# EAGLE design InstrDigitizer2 (EAGLE 8.0.1)

## Sheet 1 of 2
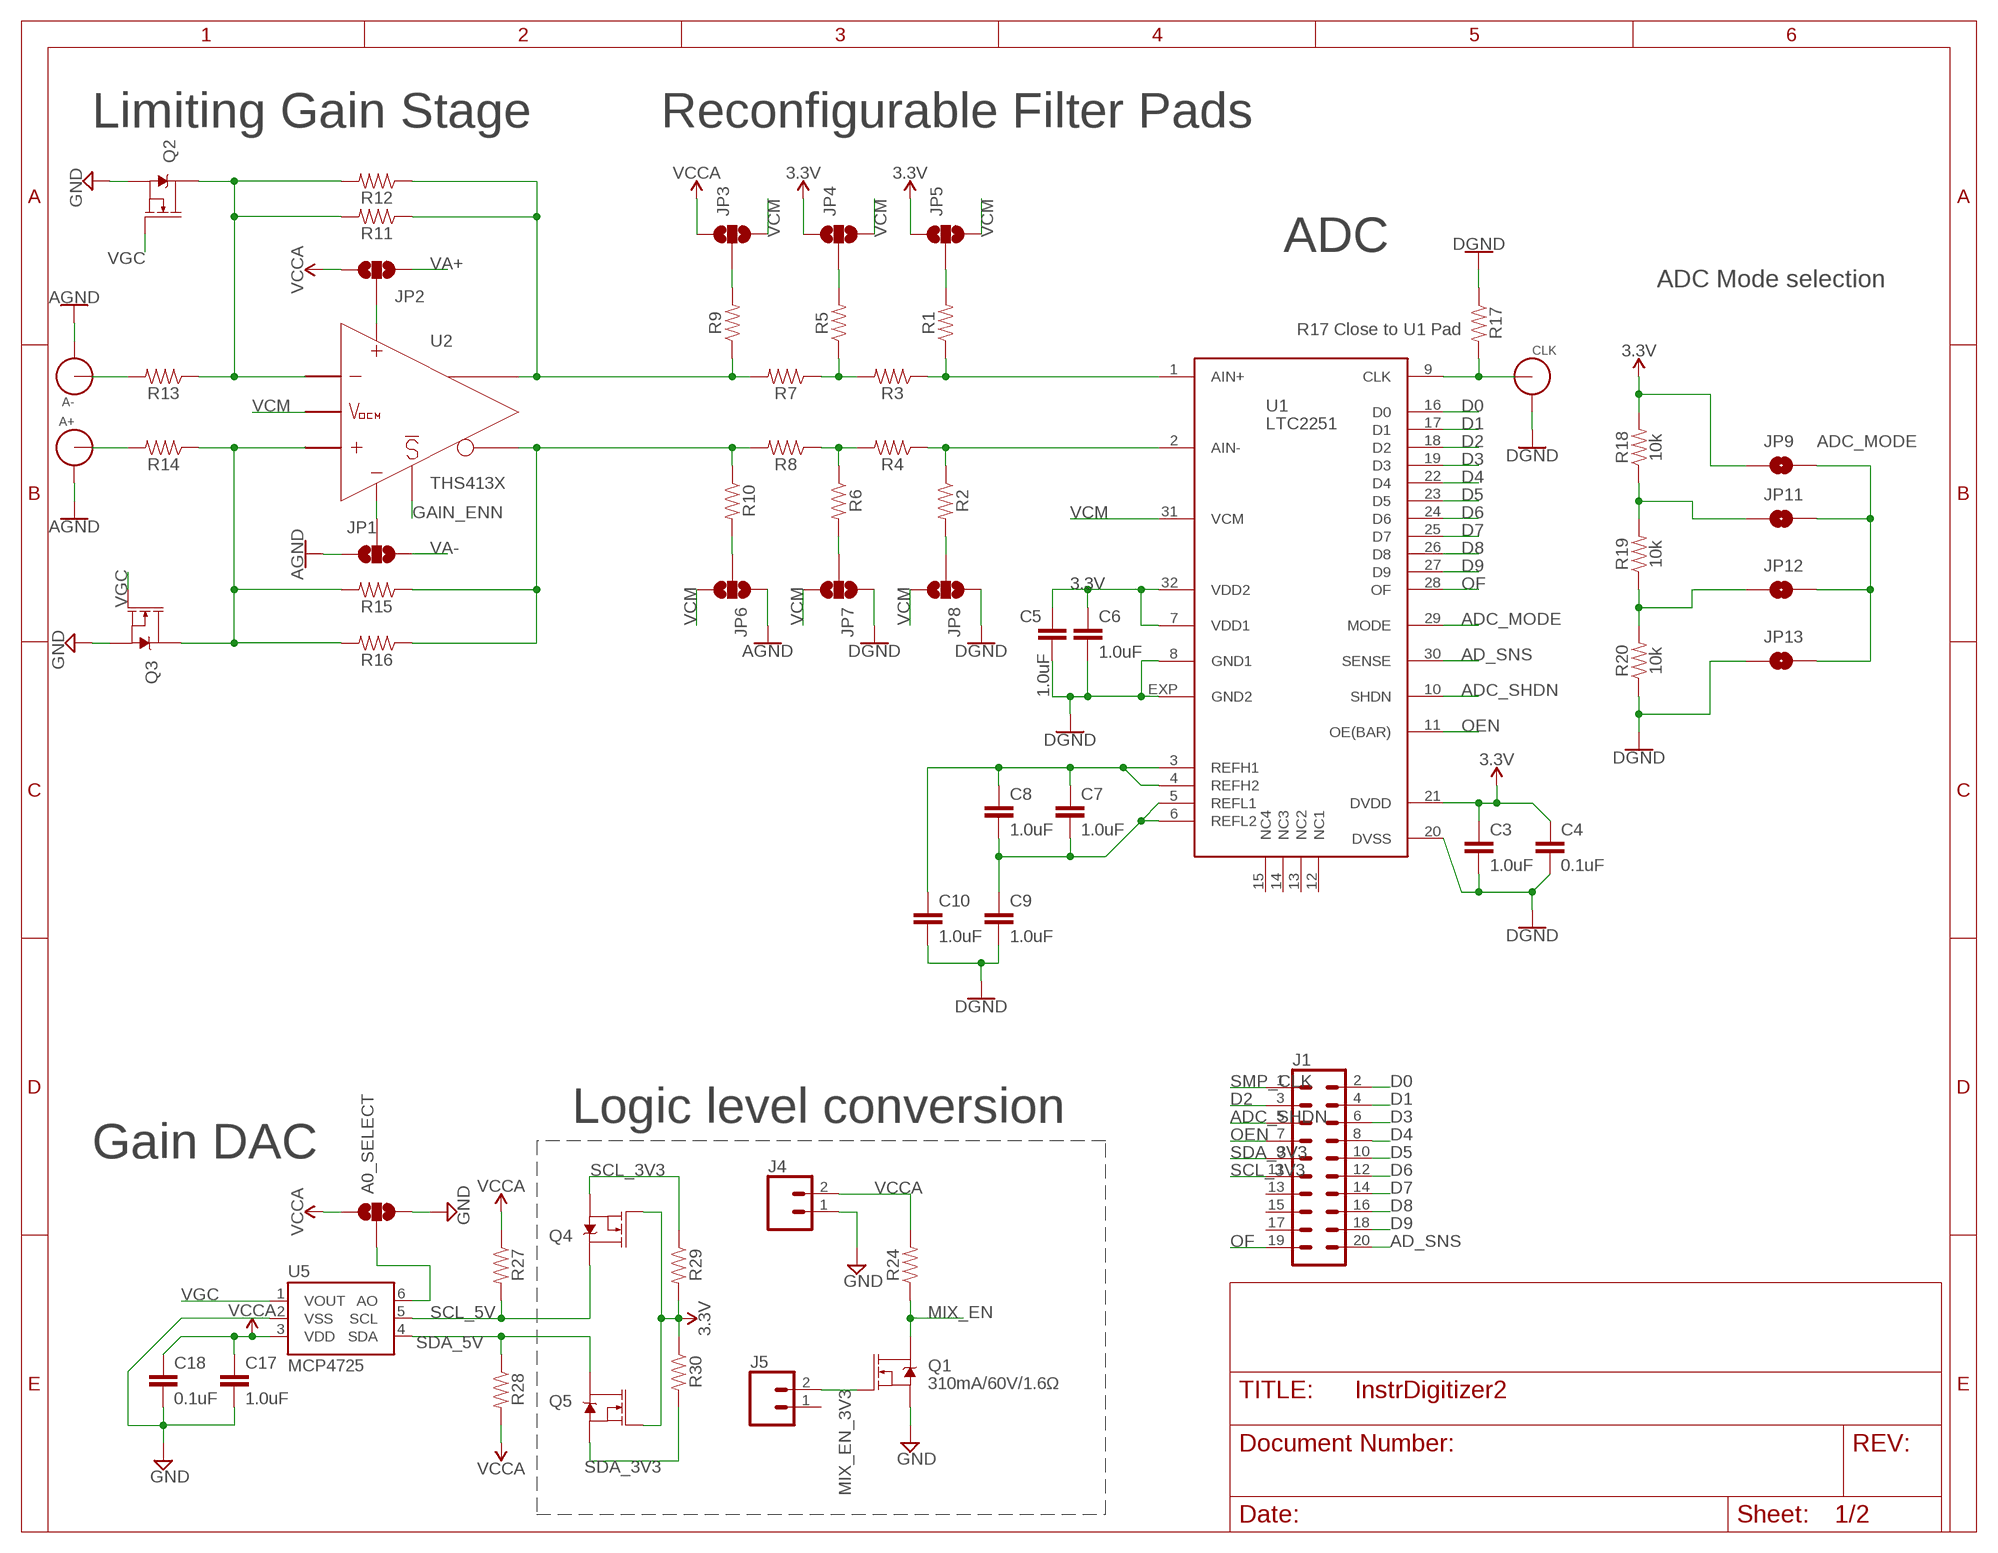
[diagram p0: schematic, sheet 1]

### Parts
A0_SELECT  JUMPER-SMT_3_NO_SILK  [SMT-JUMPER_3_NO_SILK]
A+  LINX-SMA-EDGE-0.062  [CONSMA003.062]
A-  LINX-SMA-EDGE-0.062  [CONSMA003.062]
C3  1.0uF  1.0UF-0402-16V-10%  [0402]
C4  0.1uF  0.1UF-0402-16V-10%  [0402]
C5  1.0uF  1.0UF-0402-16V-10%  [0402]
C6  1.0uF  1.0UF-0402-16V-10%  [0402]
C7  1.0uF  1.0UF-0402-16V-10%  [0402]
C8  1.0uF  1.0UF-0402-16V-10%  [0402]
C9  1.0uF  1.0UF-0402-16V-10%  [0402]
C10  1.0uF  1.0UF-0402-16V-10%  [0402]
C17  1.0uF  1.0UF-0402-16V-10%  [0402]
C18  0.1uF  0.1UF-0402-16V-10%  [0402]
CLK  LINX-SMA-EDGE-0.062  [CONSMA003.062]
J1  CONN_10X2  [2X10]
J4  CONN_02  [1X02]
J5  CONN_02  [1X02]
JP1  JUMPER-SMT_3_NO_SILK  [SMT-JUMPER_3_NO_SILK]
JP2  JUMPER-SMT_3_NO_SILK  [SMT-JUMPER_3_NO_SILK]
JP3  JUMPER-SMT_3_NO_SILK  [SMT-JUMPER_3_NO_SILK]
JP4  JUMPER-SMT_3_NO_SILK  [SMT-JUMPER_3_NO_SILK]
JP5  JUMPER-SMT_3_NO_SILK  [SMT-JUMPER_3_NO_SILK]
JP6  JUMPER-SMT_3_NO_SILK  [SMT-JUMPER_3_NO_SILK]
JP7  JUMPER-SMT_3_NO_SILK  [SMT-JUMPER_3_NO_SILK]
JP8  JUMPER-SMT_3_NO_SILK  [SMT-JUMPER_3_NO_SILK]
JP9  JUMPER-SMT_2_NO_NO-SILK  [SMT-JUMPER_2_NO_NO-SILK]
JP11  JUMPER-SMT_2_NO_NO-SILK  [SMT-JUMPER_2_NO_NO-SILK]
JP12  JUMPER-SMT_2_NO_NO-SILK  [SMT-JUMPER_2_NO_NO-SILK]
JP13  JUMPER-SMT_2_NO_NO-SILK  [SMT-JUMPER_2_NO_NO-SILK]
Q1  310mA/60V/1.6Ω  MOSFET-NCH-2N7002PW  [SOT323]
Q2  MOSFET-NCH-AO3404A  [SOT23-3]
Q3  MOSFET-NCH-AO3404A  [SOT23-3]
Q4  MOSFET-NCH-AO3404A  [SOT23-3]
Q5  MOSFET-NCH-AO3404A  [SOT23-3]
R1  RESISTOR0402  [0402]
R2  RESISTOR0402  [0402]
R3  RESISTOR0402  [0402]
R4  RESISTOR0402  [0402]
R5  RESISTOR0402  [0402]
R6  RESISTOR0402  [0402]
R7  RESISTOR0402  [0402]
R8  RESISTOR0402  [0402]
R9  RESISTOR0402  [0402]
R10  RESISTOR0402  [0402]
R11  RESISTOR0402  [0402]
R12  RESISTOR0402  [0402]
R13  RESISTOR0402  [0402]
R14  RESISTOR0402  [0402]
R15  RESISTOR0402  [0402]
R16  RESISTOR0402  [0402]
R17  RESISTOR0402  [0402]
R18  10k  RESISTOR0402  [0402]
R19  10k  RESISTOR0402  [0402]
R20  10k  RESISTOR0402  [0402]
R24  RESISTOR0402  [0402]
R27  RESISTOR0402  [0402]
R28  RESISTOR0402  [0402]
R29  RESISTOR0402  [0402]
R30  RESISTOR0402  [0402]
U1  LTC2251  [HVQFN32]
U2  THS413X  [SO08]
U5  MCP4725  MCP4725SOT-23  [SOT23-6]

### Nets
3.3V: C3.1 C4.1 C5.1 C6.1 JP4.1 JP5.1 JP9.1 Q4.1(G) Q5.1(G) R18.2 R29.2 R30.1 U1.7(VDD1) U1.21(DVDD) U1.32(VDD2) ; also sheet 2
AD_SNS: J1.20 U1.30(SENSE)
ADC_MODE: JP9.2 JP11.2 JP12.2 JP13.2 U1.29(MODE)
ADC_SHDN: J1.5 U1.10(SHDN)
AMP+: Q3.3(D) R14.1 R15.2 R16.2 U2.8
AMP-: Q2.3(D) R11.2 R12.2 R13.1 U2.1
D0: J1.2 U1.16(D0)
D1: J1.4 U1.17(D1)
D2: J1.3 U1.18(D2)
D3: J1.6 U1.19(D3)
D4: J1.8 U1.22(D4)
D5: J1.10 U1.23(D5)
D6: J1.12 U1.24(D6)
D7: J1.14 U1.25(D7)
D8: J1.16 U1.26(D8)
D9: J1.18 U1.27(D9)
GAIN_ENN: U2.7
GND: A0_SELECT.3 A+.GND1 A+.GND2 A+.GND3 A+.GND4 A-.GND1 A-.GND2 A-.GND3 A-.GND4 C3.2 C4.2 C5.2 C6.2 C9.2 C10.2 C17.2 C18.2 CLK.GND1 CLK.GND2 CLK.GND3 CLK.GND4 J4.1 JP1.3 JP6.1 JP7.1 JP8.1 JP13.1 Q1.2(S) Q2.2(S) Q3.2(S) R17.1 R20.1 U1.8(GND1) U1.20(DVSS) U1.EXP(GND2) U5.2(VSS) ; supply symbol labelled DGND, AGND ; also sheet 2
MIX_EN: Q1.3(D) R24.1 ; also sheet 2
MIX_EN_3V3: J5.2 Q1.1(G)
N$1: JP2.2 U2.3
N$2: JP1.2 U2.6
N$3: R7.2 R9.1 R11.1 R12.1 U2.4
N$4: R3.2 R5.1 R7.1
N$5: R1.1 R3.1 U1.1(AIN+)
N$6: R8.2 R10.1 R15.1 R16.1 U2.5
N$7: R4.2 R6.1 R8.1
N$8: R2.1 R4.1 U1.2(AIN-)
N$9: JP3.2 R9.2
N$10: JP4.2 R5.2
N$11: JP5.2 R1.2
N$12: JP8.2 R2.2
N$13: JP7.2 R6.2
N$14: JP6.2 R10.2
N$15: A-.ANT R13.2
N$16: A+.ANT R14.2
N$21: C7.1 C8.1 C10.1 U1.3(REFH1) U1.4(REFH2)
N$22: JP12.1 R19.1 R20.2
N$23: C7.2 C8.2 C9.1 U1.5(REFL1) U1.6(REFL2)
N$30: JP11.1 R18.1 R19.2
N$39: A0_SELECT.2 U5.6(AO)
OEN: J1.7 U1.11(OE(BAR))
OF: J1.19 U1.28(OF)
SCL_3V3: J1.11 Q4.2(S) R29.1
SCL_5V: Q4.3(D) R27.2 U5.5(SCL)
SDA_3V3: J1.9 Q5.2(S) R30.2
SDA_5V: Q5.3(D) R28.1 U5.4(SDA)
SMP_CLK: CLK.ANT J1.1 R17.2 U1.9(CLK)
VA+: JP2.3
VA-: JP1.1
VCCA: A0_SELECT.1 C17.1 C18.1 J4.2 JP2.1 JP3.1 R24.2 R27.1 R28.2 U5.3(VDD) ; also sheet 2
VCM: JP3.3 JP4.3 JP5.3 JP6.3 JP7.3 JP8.3 U1.31(VCM) U2.2
VGC: Q2.1(G) Q3.1(G) U5.1(VOUT)
Unconnected: J1.13 J1.15 J1.17 J5.1 U1.12(NC1) U1.13(NC2) U1.14(NC3) U1.15(NC4)

### Notes on the sheet
- Limiting Gain Stage | Reconfigurable Filter Pads
- ADC
- ADC Mode selection
- R17 Close to U1 Pad
- Logic level conversion
- Gain DAC

## Sheet 2 of 2
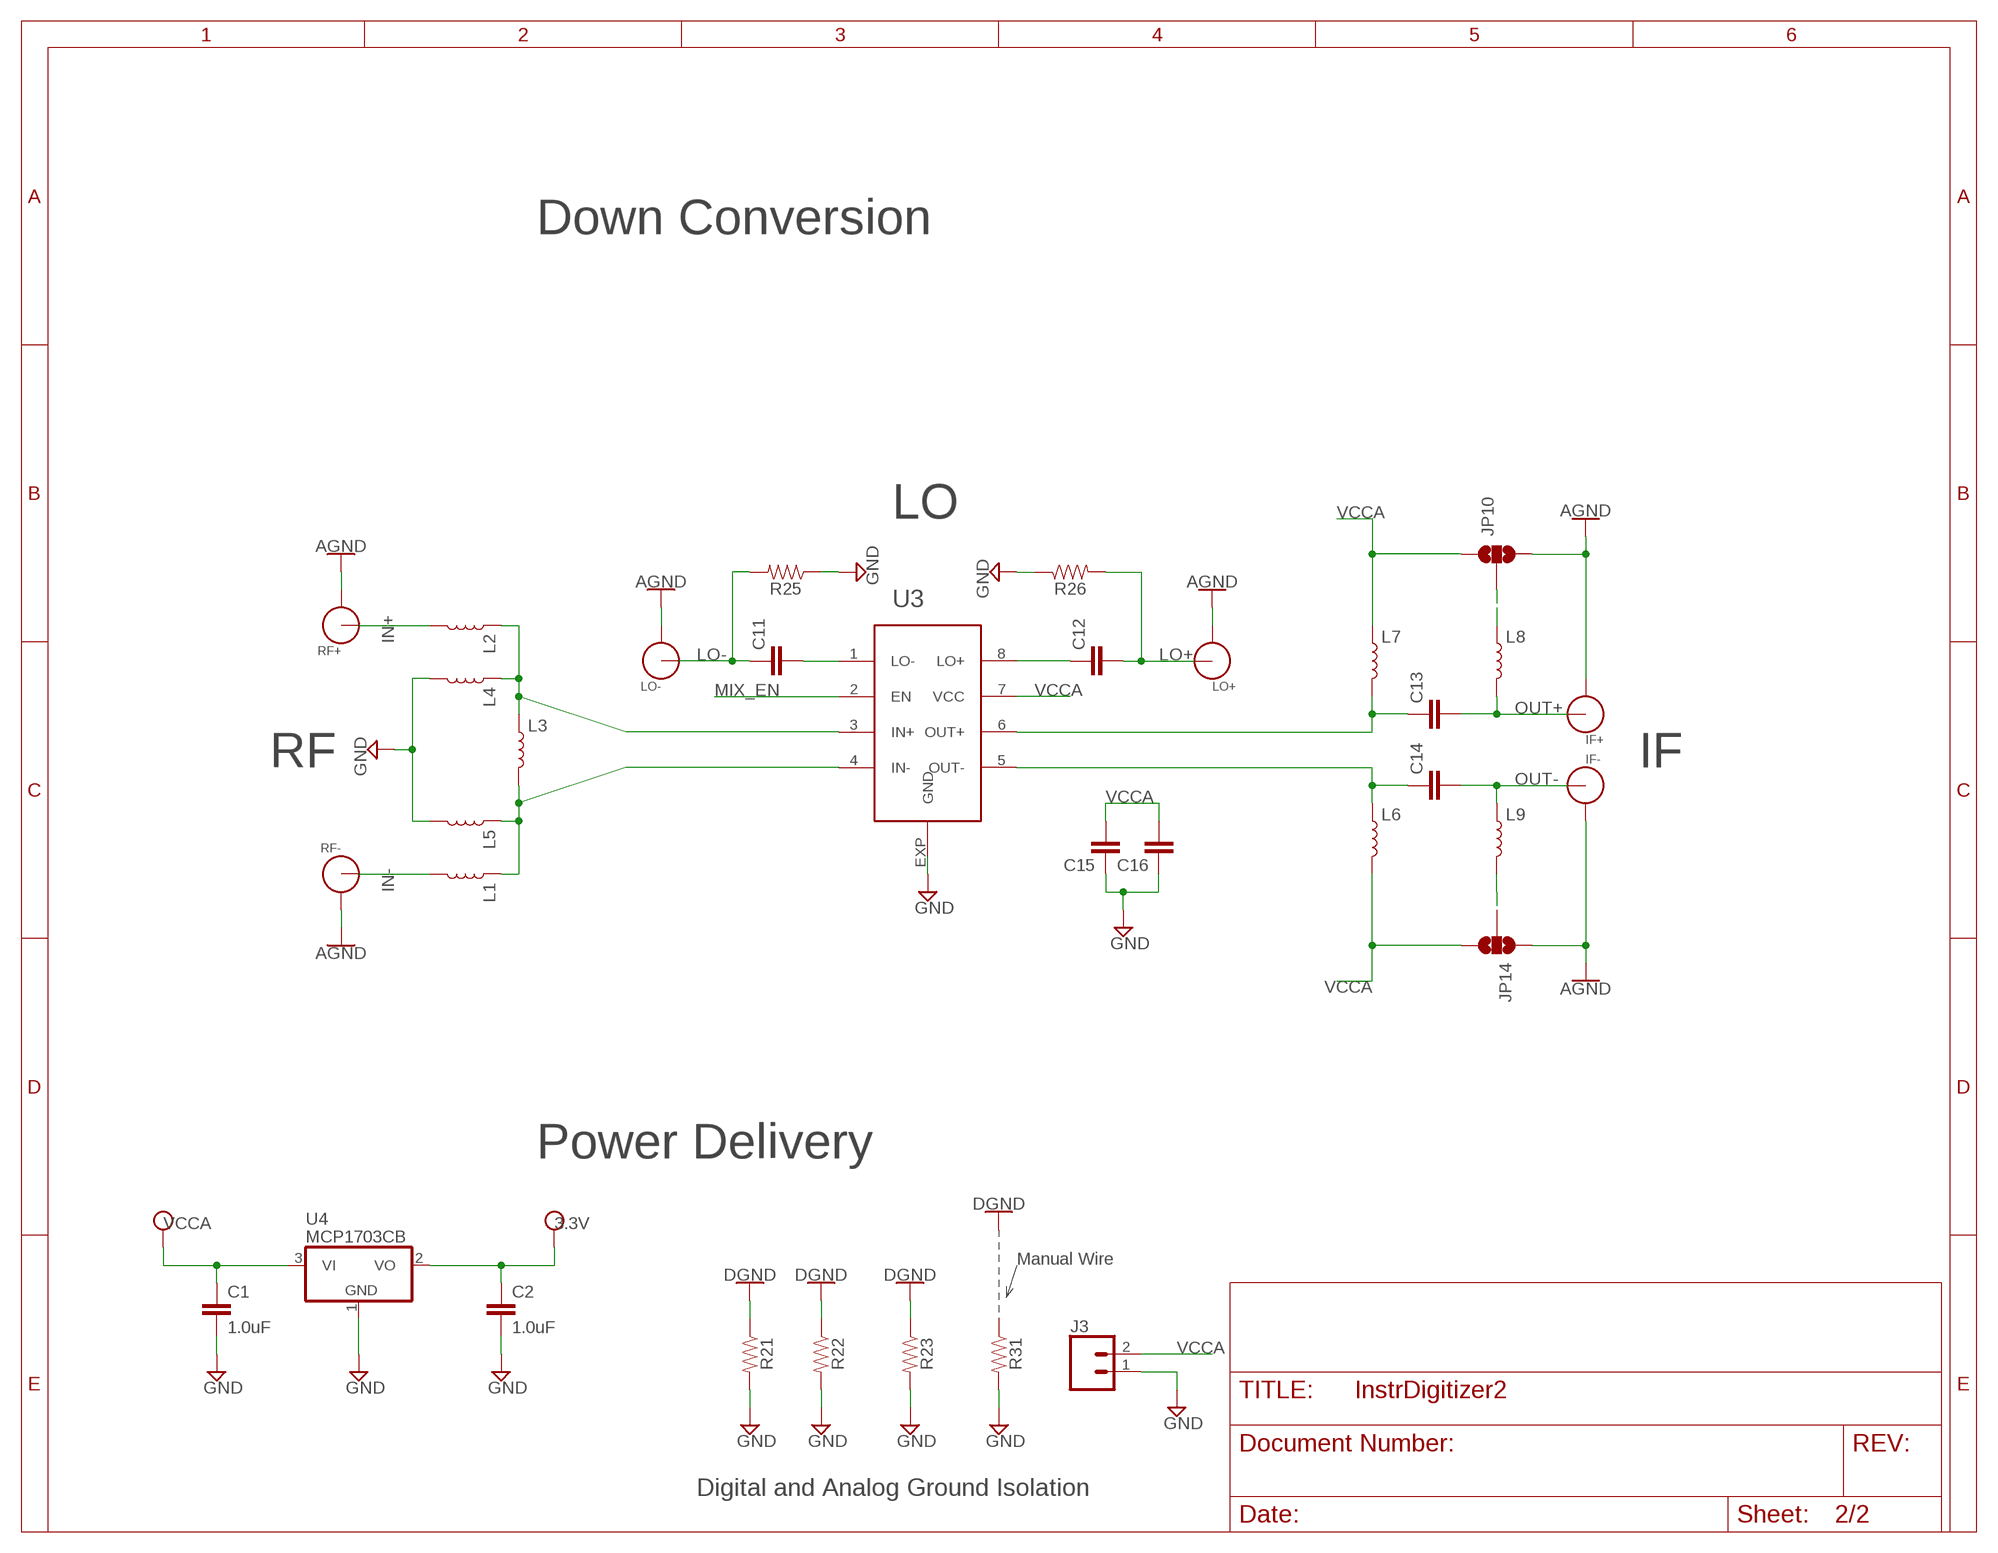
[diagram p1: schematic, sheet 2]

### Parts
C1  1.0uF  1.0UF-0402-16V-10%  [0402]
C2  1.0uF  1.0UF-0402-16V-10%  [0402]
C11  1.0UF-0402-16V-10%  [0402]
C12  1.0UF-0402-16V-10%  [0402]
C13  1.0UF-0402-16V-10%  [0402]
C14  1.0UF-0402-16V-10%  [0402]
C15  1.0UF-0402-16V-10%  [0402]
C16  1.0UF-0402-16V-10%  [0402]
IF+  LINX-SMA-EDGE-0.062  [CONSMA003.062]
IF-  LINX-SMA-EDGE-0.062  [CONSMA003.062]
J3  CONN_02  [1X02]
JP10  JUMPER-SMT_3_NO_NO-SILK  [SMT-JUMPER_3_NO_NO-SILK]
JP14  JUMPER-SMT_3_NO_NO-SILK  [SMT-JUMPER_3_NO_NO-SILK]
L1  INDUCTOR-0603-33NH  [0603]
L2  INDUCTOR-0603-33NH  [0603]
L3  INDUCTOR-0603-33NH  [0603]
L4  INDUCTOR-0603-33NH  [0603]
L5  INDUCTOR-0603-33NH  [0603]
L6  INDUCTOR-0603-33NH  [0603]
L7  INDUCTOR-0603-33NH  [0603]
L8  INDUCTOR-0603-33NH  [0603]
L9  INDUCTOR-0603-33NH  [0603]
LO+  LINX-SMA-EDGE-0.062  [CONSMA003.062]
LO-  LINX-SMA-EDGE-0.062  [CONSMA003.062]
R21  RESISTOR0402  [0402]
R22  RESISTOR0402  [0402]
R23  RESISTOR0402  [0402]
R25  RESISTOR0402  [0402]
R26  RESISTOR0402  [0402]
R31  RESISTOR0402  [0402]
RF+  LINX-SMA-EDGE-0.062  [CONSMA003.062]
RF-  LINX-SMA-EDGE-0.062  [CONSMA003.062]
U3  LT5560  [DFN8-3X3]
U4  MCP1703CB  [SOT23]

### Nets
3.3V: C2.1 U4.2(VO) ; supply symbol labelled VDD ; also sheet 1
GND: C1.2 C2.2 C15.1 C16.1 IF+.GND1 IF+.GND2 IF+.GND3 IF+.GND4 IF-.GND1 IF-.GND2 IF-.GND3 IF-.GND4 J3.1 JP10.3 JP14.1 L4.2 L5.2 LO+.GND1 LO+.GND2 LO+.GND3 LO+.GND4 LO-.GND1 LO-.GND2 LO-.GND3 LO-.GND4 R21.1 R21.2 R22.1 R22.2 R23.1 R23.2 R25.1 R26.1 R31.2 RF+.GND1 RF+.GND2 RF+.GND3 RF+.GND4 RF-.GND1 RF-.GND2 RF-.GND3 RF-.GND4 U3.EXP(GND) U4.1(GND) ; supply symbol labelled AGND, DGND ; also sheet 1
IN+: L2.2 RF+.ANT
IN-: L1.2 RF-.ANT
LO+: C12.2 LO+.ANT R26.2
LO-: C11.1 LO-.ANT R25.2
MIX_EN: U3.2(EN) ; also sheet 1
N98: L1.1 L3.2 L5.1 U3.4(IN-)
N$20: C11.2 U3.1(LO-)
N$24: C12.1 U3.8(LO+)
N$25: L2.1 L3.1 L4.1 U3.3(IN+)
N$26: C14.1 L6.1 U3.5(OUT-)
N$27: C13.1 L7.2 U3.6(OUT+)
N$37: JP10.2 L8.1
N$38: JP14.2 L9.2
OUT+: C13.2 IF+.ANT L8.2
OUT-: C14.2 IF-.ANT L9.1
VCCA: C1.1 C15.2 C16.2 J3.2 JP10.1 JP14.3 L6.2 L7.1 U3.7(VCC) U4.3(VI) ; supply symbol labelled VCC ; also sheet 1
Unconnected: R31.1

### Notes on the sheet
- Down Conversion
- LO
- U3
- RF | IF
- Power Delivery
- Manual Wire
- Digital and Analog Ground Isolation

## Library data of the parts
A0_SELECT JP1-JP8 JP10 JP14 = SparkFun-Jumpers:JUMPER-SMT_3_NO: Normally open jumper This jumper has three pads in close proximity to each other. Apply solder to close the connection(s).
A+ A- CLK IF+ IF- LO+ LO- RF+ RF- = connector:LINX-SMA-EDGE-0.062: CONN SMA JACK 50 OHM EDGE MNT; DIGIKEY: CONSMA003.062-ND
C1-C3 C5-C10 C17 = SparkFun-Capacitors:1.0UF: 1µF ceramic capacitors A capacitor is a passive two-terminal electrical component used to store electrical energy temporarily in an electric field.; PROD_ID: CAP-12417
C4 C18 = SparkFun-Capacitors:0.1UF: 0.1µF ceramic capacitors A capacitor is a passive two-terminal electrical component used to store electrical energy temporarily in an electric field.; PROD_ID: CAP-12416
C11-C16 = SparkFun-Capacitors:1.0UF: 1µF ceramic capacitors A capacitor is a passive two-terminal electrical component used to store electrical energy temporarily in an electric field.; PROD_ID: CAP-12417; VALUE: 1.0uF
J1 = SparkFun-Connectors:CONN_10X2: Multi connection point. Often used as Generic Header-pin footprint for 0.1 inch spaced/style header connections On any of the 0.1 inch spaced packages, you can populate with these: Break Away Headers - Straight <https://www.sparkfun.com/products/116> (PRT-00116) Break Away Male Headers - Right Angle <https://www.sparkfun.com/products/553> (PRT-00553) Female Headers <https://www.sparkfun.com/products/115> (PRT-00115) Break Away Headers - Machine Pin <https://www.sparkfun.com/products/117> (PRT-00117) Break Away Female Headers - Swiss Machine Pin <https://www.sparkfun.com/products/743> (PRT-00743) Special note about the "SPECIAL" package: This was SPECIALLY designed to be used with our Graphic LCD Backpack. Be sure you want to use this! It is not only staggered on each line of header holes, but IT IS ALSO offset of the center point of the top and bottom lines by 5 mil. This causes the headers to lock into place on the "standard" footprint on the LCD screen. The extra squares on the tdocu layer are there simply to reference other pins (if you were to actually populate a longer header than ten long - this is what we do with the backpacks).
J3-J5 = SparkFun-Connectors:CONN_02: Multi connection point. Often used as Generic Header-pin footprint for 0.1 inch spaced/style header connections On any of the 0.1 inch spaced packages, you can populate with these: Break Away Headers - Straight <https://www.sparkfun.com/products/116> (PRT-00116) Break Away Male Headers - Right Angle <https://www.sparkfun.com/products/553> (PRT-00553) Female Headers <https://www.sparkfun.com/products/115> (PRT-00115) Break Away Headers - Machine Pin <https://www.sparkfun.com/products/117> (PRT-00117) Break Away Female Headers - Swiss Machine Pin <https://www.sparkfun.com/products/743> (PRT-00743) For SCREWTERMINALS and SPRING TERMINALS visit here: Screw Terimnals on SparkFun.com <https://www.sparkfun.com/search/results?term=Screw+Terminals> (5mm/3.5mm/2.54mm spacing) This device is also useful as a general connection point to wire up your design to another part of your project. Our various solder wires solder well into these plated through hole pads. Hook-Up Wire - Assortment (Stranded, 22 AWG) <https://www.sparkfun.com/products/11375> (PRT-11375) Hook-Up Wire - Assortment (Solid Core, 22 AWG) <https://www.sparkfun.com/products/11367> (PRT-11367) View the entire wire category on our website here <https://www.sparkfun.com/categories/141> Special notes: Molex polarized connector foot print use with: PRT-08233 with associated crimp pins and housings. 2.54_SCREWTERM for use with PRT-10571. 3.5mm Screw Terminal footprints for PRT-08084 5mm Screw Terminal footprints for use with PRT-08432
JP9 JP11-JP13 = SparkFun-Jumpers:JUMPER-SMT_2_NO: Normally open jumper This jumper has two pads in close proximity to each other. Apply solder to close the connection. Round pads are easier to solder for beginners, but are a lot larger. SparkFun Product that uses the round pads: SparkFun EL Sequencer <https://www.sparkfun.com/products/12781>
L1-L9 = SparkFun-Coils:INDUCTOR: Inductors Resist changes in electrical current. Basically a coil of wire. SparkFun Products: SparkFun Load Cell Amplifier - HX711 <https://www.sparkfun.com/products/13879> IOIO-OTG - V2.2 <https://www.sparkfun.com/products/13613>; PROD_ID: NDUC-07874; VALUE: 33nH/±5%/500mA
Q1 = SparkFun-DiscreteSemi:MOSFET-NCH: N-channel MOSFETs Voltage controlled devices that allow control of high current outputs. SparkFun Products: SparkFun OpenScale <https://www.sparkfun.com/products/13261> SparkFun Digital Sandbox <https://www.sparkfun.com/products/12651> SparkFun Monster Moto Shield <https://www.sparkfun.com/products/10182> SparkFun MOSFET Power Controller <https://www.sparkfun.com/products/11214>; PROD_ID: TRANS-11151
Q2-Q5 = SparkFun-DiscreteSemi:MOSFET-NCH: N-channel MOSFETs Voltage controlled devices that allow control of high current outputs. SparkFun Products: SparkFun OpenScale <https://www.sparkfun.com/products/13261> SparkFun Digital Sandbox <https://www.sparkfun.com/products/12651> SparkFun Monster Moto Shield <https://www.sparkfun.com/products/10182> SparkFun MOSFET Power Controller <https://www.sparkfun.com/products/11214>; PROD_ID: TRANS-12988; VALUE: 5.8A/30V/35mΩ
R1-R31 = SparkFun-Resistors:RESISTOR: Generic Resistor Package
U1 = components:LTC2251: LTC2251 125MSPS Pipelined ADC
U2 = components:THS413X
U3 = components:LT5560
U4 = linear:MCP1703: 250 mA, 16V, Low Quiescent Current LDO Regulator Source: http://ww1.microchip.com/downloads/en/DeviceDoc/22049b.pdf
U5 = SparkFun-IC-Conversion:MCP4725: MCP4725 DAC Microchip 12-bit I2C DAC, SOT23-6 Datasheet <https://cdn.sparkfun.com/datasheets/BreakoutBoards/MCP4725_2009.pdf> SparkFun Products SparkFun I2C DAC Breakout - MCP4725 <https://www.sparkfun.com/products/12918> (BOB-12918); PROD_ID: IC-08886

## Board
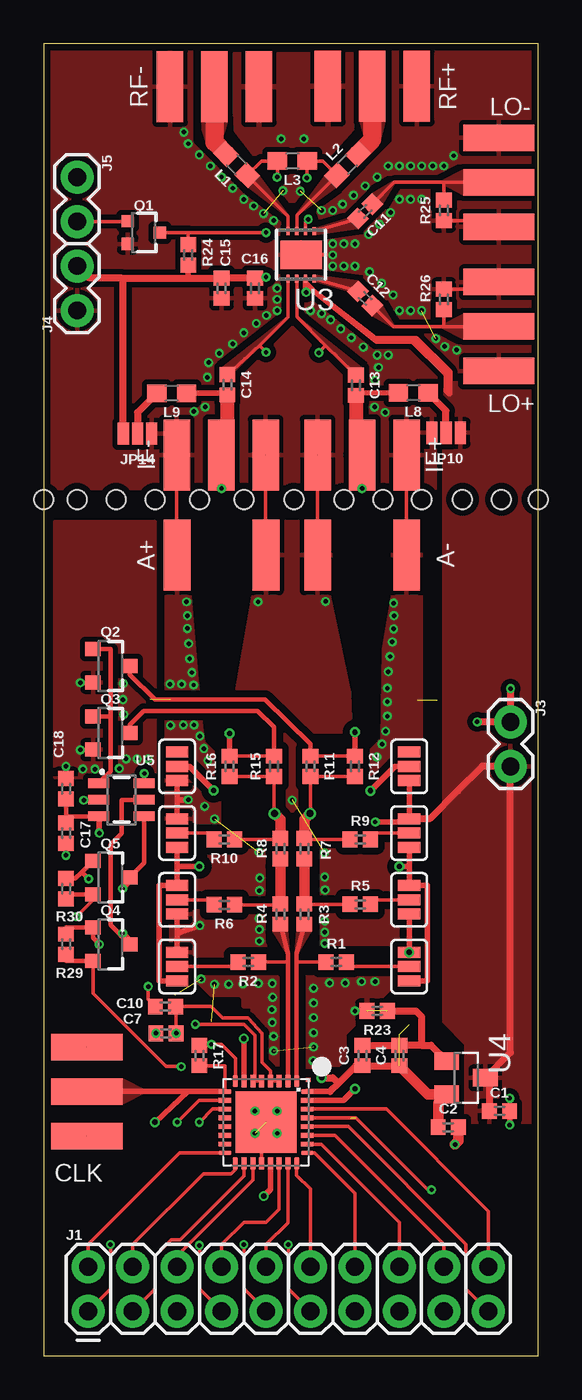
[diagram p2: board, top side]
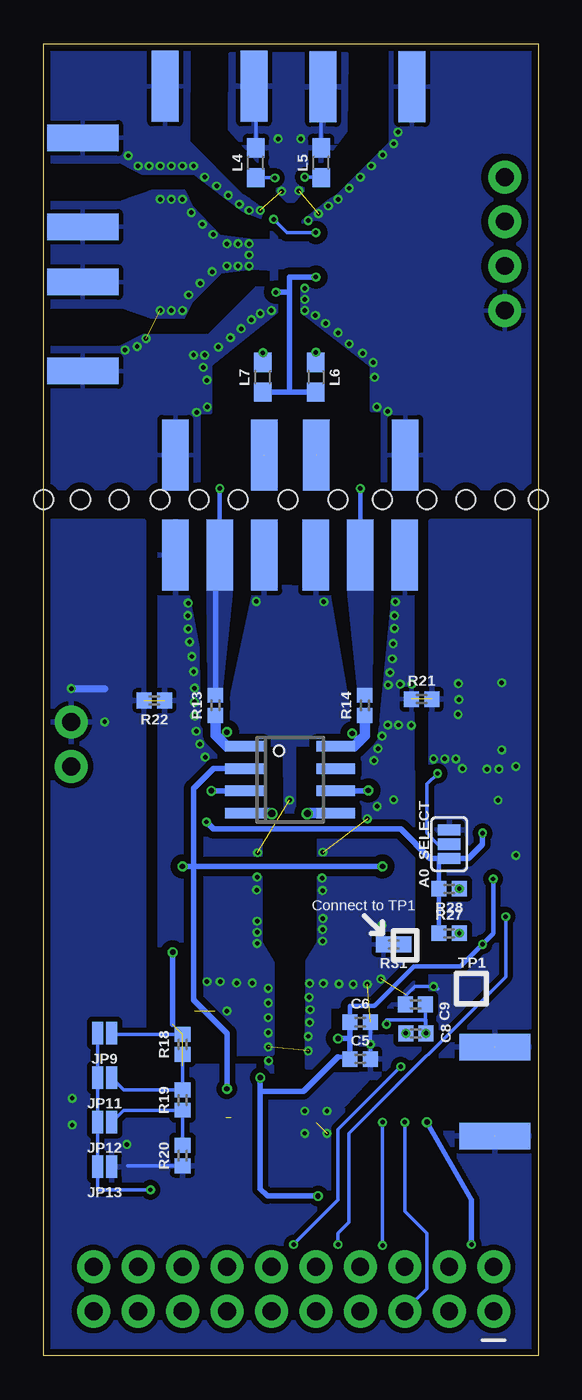
[diagram p3: board, bottom side, seen from below]

Size 28.25 x 74.92 mm. Coordinates in mm from the lower left corner, seen from the top.
Outline: 0,0 28.25,0 28.25,74.92 0,74.92 0,0
Copper layers (1*16): Top 0.0356mm / dielectric 60mil / Bottom 0.0356mm
Design rules "default *": minimum track width 6mil, minimum drill 10mil, track to track 6mil, track to pad 6mil, pad to pad 6mil, via to via 6mil, smd to smd 0mil, copper to edge 15mil, drill to drill 10mil, minimum pad ring 5mil, minimum via ring 5mil, stop-mask expansion 4mil, vias tented up to drill 20mil, thermal gap 10mil
Holes 1.1 mm at 0,48.89 1.91,48.89 6.35,48.89 8.89,48.89 11.43,48.89 14.29,48.89 17.14,48.89 19.37,48.89 21.59,48.89 23.93,48.89 26.15,48.89 28.26,48.89 4.13,48.89

### Footprints (pad centres in the part's own frame; a part is rotated, then mirrored left to right if it is on the bottom)
SMT-JUMPER_3_NO_SILK = smd 0.635 x 1.27: 1 -0.813,0; 2 0,0; 3 0.813,0
CONSMA003.062 = smd 4.06 x 1.52: ANT 0,0; GND1 0,2.54; GND2 0,-2.54 | smd 4.06 x 1.52 bottom: GND3 0,2.54; GND4 0,-2.54
0402 = smd 0.85 x 0.9: 1 -0.58,0; 2 0.58,0
2X10 = drill 1.016 pad 1.88: 1 0,0; 2 0,2.54; 3 2.54,0; 4 2.54,2.54; 5 5.08,0; 6 5.08,2.54; 7 7.62,0; 8 7.62,2.54; 9 10.16,0; 10 10.16,2.54; 11 12.7,0; 12 12.7,2.54; 13 15.24,0; 14 15.24,2.54; 15 17.78,0; 16 17.78,2.54; 17 20.32,0; 18 20.32,2.54; 19 22.86,0; 20 22.86,2.54
1X02 = drill 1.016 pad 1.88: 1 0,0; 2 2.54,0
SMT-JUMPER_2_NO_NO-SILK = smd 0.635 x 1.27: 1 -0.406,0; 2 0.406,0
SMT-JUMPER_3_NO_NO-SILK = smd 0.635 x 1.27: 1 -0.813,0; 2 0,0; 3 0.813,0
0603 = smd 1.1 x 1: 1 -0.85,0; 2 0.85,0
SOT323 = smd 0.7 x 0.7: 1 -0.65,-0.925; 2 0.65,-0.925; 3 0,0.925
SOT23-3 = smd 0.8 x 0.9: 1 -0.95,-1; 2 0.95,-1; 3 0,1.1
HVQFN32 = smd 0.7 x 0.28: 1 -2.35,1.75; 2 -2.35,1.25; 3 -2.35,0.75; 4 -2.35,0.25; 5 -2.35,-0.25; 6 -2.35,-0.75; 7 -2.35,-1.25; 8 -2.35,-1.75; 17 2.35,-1.75; 18 2.35,-1.25; 19 2.35,-0.75; 20 2.35,-0.25; 21 2.35,0.25; 22 2.35,0.75; 23 2.35,1.25; 24 2.35,1.75 | smd 0.28 x 0.7: 9 -1.75,-2.35; 10 -1.25,-2.35; 11 -0.75,-2.35; 12 -0.25,-2.35; 13 0.25,-2.35; 14 0.75,-2.35; 15 1.25,-2.35; 16 1.75,-2.35; 25 1.75,2.35; 26 1.25,2.35; 27 0.75,2.35; 28 0.25,2.35; 29 -0.25,2.35; 30 -0.75,2.35; 31 -1.25,2.35; 32 -1.75,2.35 | smd 3.5 x 3.5: EXP 0,0 | smd 0.25 x 0.25: M1 -2.415,2.415
SO08 = smd 0.6 x 2.2: 1 -1.905,-2.6; 2 -0.635,-2.6; 3 0.635,-2.6; 4 1.905,-2.6; 5 1.905,2.6; 6 0.635,2.6; 7 -0.635,2.6; 8 -1.905,2.6
DFN8-3X3 = smd 0.25 x 0.45: 1 -0.75,-1.35; 2 -0.25,-1.35; 3 0.25,-1.35; 4 0.75,-1.35; 5 0.75,1.35; 6 0.25,1.35; 7 -0.25,1.35; 8 -0.75,1.35 | smd 2.38 x 1.65: EXP 0,0
SOT23 = smd 1 x 1.4: 1 -0.95,-1.1; 2 0.95,-1.1; 3 0,1.1
SOT23-6 = smd 0.55 x 1.2: 1 0.95,1.3; 2 0,1.3; 3 -0.95,1.3; 4 -0.95,-1.3; 5 0,-1.3; 6 0.95,-1.3

### Placement (x,y rotation side)
A0_SELECT  5.08,29.21 90 bottom
A+  10.16,45.72 90 bottom
A-  18.19,45.72 270 bottom
C1  26.04,13.97 0 top
C2  23.11,13.06 0 top
C3  18.21,17.14 90 top
C4  20.32,17.14 90 top
C5  10.16,16.94 0 bottom
C6  10.16,19.05 0 bottom
C7  6.99,18.41 180 top
C8  6.99,18.41 0 bottom
C9  7.01,20.07 180 bottom
C10  6.96,19.94 180 top
C11  18.36,65.35 225 top
C12  18.36,60.38 315 top
C13  17.83,55.42 270 top
C14  10.49,55.45 270 top
C15  10.16,60.96 90 top
C16  12.06,60.96 90 top
C17  1.27,29.84 270 top
C18  1.27,32.38 90 top
CLK  2.46,15.09 0 top
IF+  18.19,51.44 90 top
IF-  10.13,51.44 270 top
J1  2.54,2.54 0 top
J3  26.67,36.2 270 top
J4  1.91,59.69 90 top
J5  1.91,67.31 270 top
JP1  7.62,33.66 270 top
JP2  20.88,33.66 90 top
JP3  20.88,29.84 270 top
JP4  20.88,26.03 90 top
JP5  20.88,22.22 270 top
JP6  7.62,29.84 270 top
JP7  7.62,26.03 90 top
JP8  7.62,22.22 270 top
JP9  24.77,18.41 180 bottom
JP10  22.99,52.7 180 top
JP11  24.77,15.88 180 bottom
JP12  24.77,13.34 180 bottom
JP13  24.77,10.79 180 bottom
JP14  5.36,52.65 180 top
L1  11.02,68.02 135 top
L2  17.35,68.02 45 top
L3  14.2,68.22 180 top
L4  16.13,68.12 90 bottom
L5  12.4,68.12 90 bottom
L6  12.7,55.88 270 bottom
L7  15.72,55.88 90 bottom
L8  21.11,54.99 180 top
L9  7.32,54.97 180 top
LO+  26.01,58.78 0 top
LO-  26.01,67.01 0 top
Q1  5.71,64.14 270 top
Q2  3.81,39.4 270 top
Q3  3.81,35.56 270 top
Q4  3.81,23.49 270 top
Q5  3.81,27.3 270 top
R1  16.71,22.48 0 top
R2  11.68,22.48 180 top
R3  14.88,25.22 90 top
R4  13.51,25.22 90 top
R5  18.08,25.78 0 top
R6  10.31,25.76 180 top
R7  14.88,28.96 90 top
R8  13.51,28.96 90 top
R9  18.08,29.49 0 top
R10  10.31,29.49 180 top
R11  15.24,33.66 90 top
R12  17.78,33.66 90 top
R13  18.44,37.13 90 bottom
R14  9.91,37.13 90 bottom
R15  13.16,33.66 90 top
R16  10.62,33.66 90 top
R17  8.89,17.14 270 top
R18  20.32,17.78 90 bottom
R19  20.32,14.61 90 bottom
R20  20.32,11.43 90 bottom
R21  6.65,37.49 0 bottom
R22  21.92,37.41 180 bottom
R23  19.05,19.68 180 top
R24  8.26,62.86 270 top
R25  22.86,65.41 90 top
R26  22.86,60.33 270 top
R27  5.08,24.13 0 bottom
R28  5.08,26.67 180 bottom
R29  1.27,23.49 90 top
R30  1.27,26.67 270 top
R31  8.26,23.49 180 bottom
RF+  18.77,72.49 270 top
RF-  9.75,72.47 90 top
U1  12.7,13.34 270 top
U2  14.17,32.89 270 bottom
U3  14.71,62.86 180 top
U4  24.13,15.88 270 top
U5  4.45,31.75 90 top

### Tracks (layer width: path | path; a pad name or v marks a point on that pad's centre or on a via)
3.3V  (via drill 0.25 pad 0.25, 0.3 pad 0.25, 0.3 pad 0.41)  (2 unrouted)
  Top 0.203: 11.45,18.09 v11.43,18.11 | C3.1 17.84,16.56
  Top 0.254: 2.16,27.61 Q5.1 | 2.16,27.61 1.8,27.25 R30.1 | R29.2 1.27,24.45 Q4.1 2.81,23.86 v3.17,23.49 | v2.56,27.23 2.19,27.61 2.16,27.61
  Top 0.305: U1.21 12.95,9.5 v12.57,9.12 | 11.45,18.09 U1.7 | JP4.1 JP5.1 | U1.32 16.36,15.09
  Top 0.406: C3.1 C4.1 | 16.83,15.56 17.84,16.56 | 16.83,15.56 16.36,15.09 | v15.88,15.88 16.51,15.88 16.83,15.56
  Top 0.61: C4.1 21.96,14.93 U4.2 22.53,14.43 C2.1
  Bottom 0.203: 7.09,22.22 6.99,22.22 | JP9.1 24.3,18.36 R18.2
  Bottom 0.254: 7.09,22.22 9.35,19.96 10.74,19.96 C6.1 | 6.99,22.22 4.45,22.22 v3.17,23.49 2.56,24.1 v2.56,27.23 | 11.43,17.07 10.74,17.07 C5.1
  Bottom 0.305: C5.1 10.74,18.11 | v11.43,18.11 10.74,18.11 | v12.57,9.12 15.47,9.12 15.88,9.52 15.88,15.09 | v15.88,15.88 15.88,15.09 | 20.88,18.92 JP5.1 | C6.1 10.74,18.11 | 15.88,15.09 13.41,15.09 11.43,17.07
  other vias: 20.88,23.04
AD_SNS
  Top 0.203: U1.30 19.57,14.09 25.4,8.25 J1.20
ADC_MODE  (via drill 0.25 pad 0.25)  (1 unrouted)
  Top 0.203: U1.29 17.53,13.59 | 17.14,13.59 17.84,13.59 20.47,10.95 | 20.47,10.95 20.62,10.79 | 20.47,10.95 21.95,9.47 v22.15,9.47
  Bottom 0.203: JP9.2 JP11.2 JP12.2 JP13.2 25.17,9.47 v22.15,9.47
ADC_SHDN  (via drill 0.25 pad 0.25)
  Top 0.203: U1.10 8.87,14.59 v7.62,13.34
  Bottom 0.203: v7.62,13.34 7.62,8.25 6.35,6.98 6.35,3.81 J1.5
AMP+  (via drill 0.3 pad 0.25)
  Top 0.203: R15.2 R16.2
  Top 0.254: Q3.3 4.91,36.02 5.71,36.83 12.22,36.83 13.16,35.89 R15.2
  Top 0.305: v10.62,35.53 R16.2
  Bottom 0.254: v10.62,35.53 10.08,34.98 11.45,34.92 U2.8
  Bottom 0.61: U2.8 10.52,34.8 9.91,35.41 R14.1
AMP-  (via drill 0.3 pad 0.25)
  Top 0.203: R11.2 R12.2
  Top 0.254: Q2.3 4.91,38.91 6.35,37.46 12.64,37.46 15.24,34.92 R11.2
  Top 0.305: v17.78,35.61 R12.2
  Bottom 0.254: v17.78,35.61 18.34,35.13 17.86,34.8 16.88,34.9 U2.1
  Bottom 0.61: U2.1 17.78,34.8 18.44,35.46 R13.1
  pour Bottom (no thermals): 16.51,34.92 16.51,34.65 16.54,34.62 16.99,34.92
D0
  Top 0.203: U1.16 7.78,11.59 2.54,6.35 J1.2
D1
  Top 0.203: J1.4 5.08,6.35 9.12,10.39 10.69,10.39 10.95,10.64 U1.17
D2
  Top 0.203: U1.18 11.45,10.28 7.8,6.63 7.26,6.63 6.35,5.71 6.35,3.81 J1.3
D3
  Top 0.203: U1.19 11.95,10.04 7.62,5.71 J1.6
D4
  Top 0.203: U1.22 13.45,8.37 12.7,7.62 11.43,7.62 10.16,6.35 J1.8
D5
  Top 0.203: U1.23 13.95,7.6 12.7,6.35 J1.10
D6
  Top 0.203: U1.24 14.45,10.31 15.24,9.52 J1.12
D7
  Top 0.203: U1.25 15.47,11.59 17.78,9.27 J1.14
D8
  Top 0.203: U1.26 15.86,12.09 20.32,7.62 J1.16
D9
  Top 0.203: U1.27 16.62,12.59 22.86,6.35 J1.18
GND  (via drill 0.25 pad 0.25, 0.25 pad 0.3)  (16 unrouted)
  Top 0.203: C3.2 18.16,17.78 | U1.8 10.95,16.99 10.16,17.78 v9.58,17.78 9.53,17.72 R17.1 | v12.06,12.7 12.45,12.31 U1.20 | R26.1 25.62,60.91 arc90 LO+.GND1 | R25.1 25.68,64.83 arc-90 LO-.GND4 | IF-.GND4 7.59,45.72 A+.GND4 | IF-.GND1 12.68,45.72 A+.GND3 | IF+.GND4 A-.GND4 | IF+.GND1 A-.GND3 | v16.51,62.86 U3.EXP | C10.2 5.97,20.35 v5.97,21.08
  Top 0.254: Q2.2 2.81,38.43 v2.08,38.43 | Q3.2 2.81,34.59 v2.08,34.59 | C18.2 v1.27,33.66 | C17.2 v1.27,28.58 | U5.2 2.29,31.75 v2.29,31.73 | C1.2 v26.61,14.7 v26.62,14.71
  Top 0.305: 7.62,24.13 JP8.1 | 7.62,31.75 JP6.1 | R23.2 v17.78,19.68 | 7.62,31.75 v8.26,31.75 | 7.62,24.13 v8.91,24.56 | JP7.1 7.62,24.13 | JP1.3 7.62,31.75 | v26.62,13.18 C1.2
  Top 0.406: C3.2 C4.2 21.59,17.72 | v26.67,38.1 J3.1 v24.77,36.2 | 21.59,17.72 22.13,17.72 U4.1 | 21.59,17.72 21.59,19.37 21.27,19.68 R23.1
  Top 0.61: C2.2 23.69,12.26 v23.5,12.06
  Bottom 0.203: C6.2 v9.58,17.78 C5.2 | R20.1 23.44,10.85 | L5.2 12.39,72.06 RF-.GND4 | L4.2 16.13,72.06 RF+.GND4 | 5.71,20.95 5.84,20.95 v5.97,21.08 7.04,21.08 7.52,20.6 7.52,20.14 C9.2
  Bottom 0.406: v26.67,38.1 24.77,38.1
  other vias: 12.27,21.26 13.08,20.47 13.03,19.76 11.38,21.23 10.57,21.21 9.75,21.21 13.06,19.02 13.13,18.24 13.13,17.4 15.39,16.84 15.42,17.63 15.42,18.44 15.42,19.3 15.42,20.14 15.42,20.98 16.33,21.29 17.22,21.29 18.16,21.36 18.92,21.36 8.99,21.51 12.06,13.97 13.34,13.97 13.34,12.7 12.32,23.67 12.32,24.33 12.29,24.97 12.32,26.57 12.34,27.28 12.29,28.75 9.75,30.66 9.19,31.37 8.15,43.05 8.56,38.3 7.87,38.35 8.59,36.02 9.14,34.67 9.37,33.99 16.05,23.55 16.05,24.18 16.05,24.82 16.08,26.59 16.05,27.33 16.03,28.73 19.02,34.19 19.33,34.92 19.53,35.66 19.63,37.34 19.99,42.98 13.06,21.26 12.24,43.05 14.2,31.72 16.1,43.08 22.86,67.94 22.23,67.94 21.59,67.94 20.95,67.94 20.32,67.94 19.68,67.94 19.05,67.31 18.36,66.8 17.7,66.27 17.07,65.76 16.51,65.41 15.88,65.41 16.51,63.5 16.51,62.23 17.14,62.23 17.78,62.23 17.14,63.5 17.78,63.5 18.57,64.03 19.18,64.62 19.81,65.28 20.32,66.04 20.95,66.04 21.59,66.04 18.62,61.9 19.3,61.24 19.96,60.58 20.32,59.69 20.95,59.69 22.91,57.63 23.6,57.43 19.05,57.15 18.26,57.61 17.58,58.14 16.97,58.65 16.38,59.16 15.88,59.51 15.24,59.69 13.34,60.96 13.34,60.33 13.34,59.69 12.73,59.41 12.14,58.95 11.43,58.42 10.79,57.78 13.13,64.82 12.55,65.23 11.99,65.66 11.43,66.04 10.79,66.67 10.16,67.31 9.53,67.94 8.89,68.58 8.26,69.22 10.03,57.25 9.42,56.72 9.35,55.88 19.68,57.15 8.46,39.01 8.33,39.8 8.28,40.67 8.2,41.53 8.2,42.27 7.98,36.02 7.24,35.99 7.21,38.35 8.92,35.38 19.63,36.53 19.63,38.13 19.68,39.07 19.79,39.93 19.91,40.77 19.99,41.5 20.02,42.27 21.59,59.69 22.4,58.09 23.42,68.53 8,69.88 9.22,54.18 8.59,53.92 19.13,56.44 18.92,55.7 18.9,54.18 19.51,53.87 13.67,66.52 14.66,66.5 13.56,69.49 14.86,69.49 5.97,34.09 5.33,34.09 4.7,34.09 4.32,33.53 2.92,33.5 2.24,33.5 4.55,38.38 4.52,37.46 4.57,36.63
  pour Bottom (isolate 0.406, rank 2): 21.59,47.62 21.59,17.27 15.21,17.27 15.21,22.43 15.9,23.57 15.9,30.48 16.51,30.48 16.51,34.29 17.78,34.29 17.78,35.08 18.62,35.92 20.09,43.59 20.12,43.61 20.12,47.62
  pour Bottom (isolate 0.406, rank 3): 13.23,16.43 13.21,22.53 12.55,23.57 12.55,30 arc90 12.06,30.48 12.06,33.66 9.09,35.08 8.28,43.61 8.26,46.99 7.16,46.99 7.14,19.91 11.91,19.91 11.96,16.43
  pour Bottom (isolate 0.406, rank 2): 12.06,43.81 10.87,36.8 10.9,36.14 12.06,34.92 13.97,34.92 13.97,31.12 14.4,31.12 14.43,34.92 16.51,34.92 17.78,36.2 16.13,43.92
  pour Bottom (isolate 0.305, rank 2): 22.53,47.62 22.53,16.51 15.24,16.51 15.24,14.61 13.21,14.61 13.21,16.05 10.16,16.05 10.16,19.05 6.12,19.05 6.12,47.62 0,47.62 0,17.14 5.71,17.14 6.99,15.88 9.65,15.9 11.43,13.97 6.99,13.97 5.71,12.7 0,12.7 0,0 28.57,0 28.57,47.62
  pour Top (isolate 0.305, rank 2, no thermals): 13.34,16.51 13.34,21.59 8.89,21.59 8.89,21.34 9.63,20.62 11.2,20.62 arc-90 11.43,20.4 11.43,19.99 11.96,19.99 11.96,19.05 12.42,18.47 12.42,16.51
  pour Top (isolate 0.406, rank 2): 14.61,16.51 14.61,21.59 15.24,21.59 19.68,21.59 19.68,20.95 17.14,18.41 17.14,16.51
  pour Top (isolate 0.406, rank 2): 6.99,47.62 6.99,22.22 13.34,22.22 13.23,22.48 12.57,23.55 12.57,30.18 10.06,30.18 10.06,34.14 9.14,35.05 9.02,35.89 8.76,38.61 8.36,43.36 8.26,47.62
  pour Top (isolate 0.406, rank 2): 21.59,47.62 21.59,23.49 15.88,23.49 15.88,30.15 18.39,30.15 18.39,34.29 19.33,35.23 19.41,40.34 19.91,43.33 19.91,47.62
  pour Top (isolate 0.406, rank 2): 12.06,47.62 12.06,43.38 11.96,43.38 10.97,37.77 10.9,36.25 11.38,35.59 12.88,35.61 13.18,35.31 13.18,34.87 13.92,34.87 13.92,31.09 14.45,31.09 14.45,34.87 15.14,34.87 15.16,34.9 15.16,35.31 15.47,35.61 17.09,35.61 17.12,35.64 17.53,36.4 17.48,37.87 16.33,43.33 16.48,47.62
  pour Top (isolate 0.305, rank 2): 0.1,74.93 0.1,49.53 28.57,49.53 28.57,74.93 19.96,74.93 19.96,69.32 16.92,66.24 15.04,64.92 14.83,64.64 13.56,64.69 13.51,64.74 11.86,66.01 11.48,66.22 8.43,69.27 8.43,74.93
  pour Bottom (isolate 0.406, rank 2): 0.1,74.93 0.1,49.53 8.89,49.53 8.89,53.98 9.53,53.98 9.53,56.52 13.49,59.59 13.49,62.13 14.94,62.13 14.94,59.59 18.72,56.57 18.72,53.85 19.38,53.85 19.38,49.53 28.57,49.53 28.57,57.61 23.9,57.56 22.58,58.27 18.82,58.27 16.13,60.96 15.24,60.96 15.24,64.77 16.89,65.41 19.66,67.54 22.56,67.51 23.88,68.2 28.57,68.17 28.57,74.93 19.94,74.93 19.96,69.32 16.92,66.24 16.48,65.99 14.99,64.9 14.96,63.68 13.44,63.68 13.44,64.8 11.86,66.01 11.48,66.22 8.43,69.27 8.43,74.93
  pour Bottom (isolate 0.406, rank 2): 28.57,59.87 28.57,65.84 23.8,65.84 23.72,65.91 22.02,66.5 20.22,66.5 19.84,65.66 18.21,63.93 16.23,63.68 15.04,63.7 15.04,62.03 16.33,62.1 18.14,61.87 19.81,60.22 20.27,59.31 20.42,59.31 22,59.28 23.7,59.87
  pour Top (isolate 0.305, rank 2): 17.65,74.3 10.79,74.3 11.02,69.95 12.06,68.58 13.03,67.61 13.03,66.88 13.92,65.99 14.3,65.99 15.24,66.93 15.24,67.41 17.58,70.05
  pour Bottom (isolate 0.305, rank 2): 17.55,74.3 10.97,74.32 11.02,69.95 12.06,68.58 13.03,67.61 13.16,66.95 13.97,65.99 14.3,65.99 15.24,66.93 15.24,67.41 17.58,70.03
  pour Top (isolate 0.305, rank 2): 0.64,47.62 0.64,33.02 6.35,33.02 6.35,47.62
IN+
  Top 1.016: L2.2 18.77,69.44 RF+.ANT
  pour Top (no thermals): 18.41,69.22 19.15,69.32 19.43,70.48 18.9,71.37 18.11,70.54 18.34,69.72
IN-
  Top 1.016: RF-.ANT 9.75,69.29 L1.2
  pour Top (isolate 0.254, no thermals): 9.53,69.22 9.35,69.24 9.09,70.03 9.09,70.64 10.41,70.64 10.41,70.41 10.11,69.42
LO+
  Top 0.203: C12.2 19.96,58.78 22.86,58.78 | 22.86,58.78 LO+.ANT | R26.2 22.86,58.78
  pour Top (no thermals): 24.77,59.05 24,59.44 22.71,58.78 24,58.12
  pour Top (no thermals): 19.05,59.69 19.3,59.92 19.96,58.78 18.85,59.41
LO-
  Top 0.203: C11.1 20.02,67 22.86,67 | 22.86,67 LO-.ANT | R25.2 22.86,67
  pour Top (no thermals): 24.77,67.31 24,67.67 22.71,67.01 24,66.34
  pour Top (no thermals): 19.05,66.04 18.82,66.27 18.82,66.29 20.02,67.01 19.3,65.81
MIX_EN  (via drill 0.25 pad 0.25)
  Top 0.203: 8.26,64.14 Q1.3 | 8.26,64.14 v12.7,64.14 | v15.11,64.9 14.96,64.74 U3.2 | R24.1 8.26,64.14
  Bottom 0.203: v12.7,64.14 14.35,64.14 v15.11,64.9
MIX_EN_3V3
  Top 0.203: Q1.1 4.79,64.77 J5.2
N98  (via drill 0.25 pad 0.25)
  Top 0.203: U3.4 13.96,65.09 L1.1 12.43,68.22 L3.2 13.35,67.32 v13.34,67.31
  Bottom 0.203: v13.34,67.31 12.43,67.31 L5.1
  pour Top (no thermals): 12.06,67.31 12.29,67.31 13.94,65.07 11.73,66.75
N$1  (via drill 0.3 pad 0.25)
  Top 0.305: v18.67,32.26 20.07,33.66 JP2.2
  Bottom 0.305: U2.3 v18.67,32.26
N$2  (via drill 0.3 pad 0.25)
  Top 0.305: v9.7,32.28 8.33,33.66 JP1.2
  Bottom 0.203: 9.73,32.26 arc-90 v9.7,32.28
  Bottom 0.305: U2.6 9.73,32.26
N$3  (via drill 0.41 pad 0.61)
  Top 0.203: R9.1 14.88,29.49 | 15.24,30.99 R11.1 R12.1
  Top 0.254: R7.2 14.88,29.49 | 15.24,30.99 v15.21,30.96
  Top 0.61: v15.21,30.96 14.88,30.63 R7.2
  Bottom 0.61: U2.4 15.24,30.99 v15.21,30.96
N$4
  Top 0.203: R5.1 14.88,25.78
  Top 0.254: 14.88,25.78 R3.2
  Top 0.61: R3.2 R7.1
N$5
  Top 0.203: R1.1 14.45,22.48
  Top 0.254: U1.1 14.45,22.48 14.45,22.94 R3.1
  pour Top (no thermals): 14.83,24.43 14.55,24.33 14.45,22.96 15.21,24.28
N$6  (via drill 0.41 pad 0.61)
  Top 0.203: R10.1 13.51,29.49 | R16.1 R15.1 13.16,30.99
  Top 0.254: R8.2 13.51,29.49 | 13.16,30.99 v13.18,30.96
  Top 0.61: v13.18,30.96 13.51,30.63 R8.2
  Bottom 0.61: U2.5 13.16,30.99 v13.18,30.96
N$7
  Top 0.203: R6.1 13.51,25.76
  Top 0.254: 13.51,25.76 R4.2
  Top 0.61: R4.2 R8.1
N$8
  Top 0.203: R2.1 13.95,22.48
  Top 0.254: U1.2 13.95,22.48 13.95,22.93 R4.1
  pour Top (no thermals): 13.36,24.38 13.84,24.33 13.94,22.96 13.18,24.23
N$9
  Top 0.203: R9.2 19.02,29.84 JP3.2
N$10
  Top 0.203: R5.2 18.92,26.03 JP4.2
N$11
  Top 0.203: R1.2 17.55,22.22 JP5.2
N$12
  Top 0.203: JP8.2 10.85,22.22 R2.2
N$13
  Top 0.203: JP7.2 9.45,26.03 R6.2
N$14
  Top 0.203: JP6.2 9.38,29.84 R10.2
N$15  (via drill 0.25 pad 0.25)
  Bottom 0.254: A-.ANT v18.19,49.53
  Bottom 0.305: R13.2 18.44,45.47 A-.ANT
  pour Bottom (no thermals): 18.21,37.57 18.11,38.18 17.55,43.69 18.82,43.69 18.77,38.18
N$16  (via drill 0.25 pad 0.25)
  Bottom 0.254: A+.ANT v10.16,49.53
  pour Bottom (no thermals): 10.16,37.46 9.58,38.02 9.53,43.71 10.79,43.71 10.24,38.18
N$20
  Top 0.203: 15.5,64.22 U3.1 C11.2
  pour Top (no thermals): 17.78,64.77 17.42,64.9 15.54,64.34 15.54,64.08 17.93,64.41
N$21  (via drill 0.25 pad 0.25)
  Top 0.203: U1.3 U1.4 12.95,16.26 12.47,16.74 12.47,18.41 11.66,19.28 10.21,19.28 9.55,19.94 C10.1 7.57,19.91 C7.1
  other vias: 7.57,18.41
N$22
  Bottom 0.203: R20.2 R19.1 23.67,14.02 JP12.1
N$23  (via drill 0.25 pad 0.25)
  Top 0.203: U1.5 U1.6 | 11.94,15.68 U1.6 | U1.6 12.06,15.68 12.06,18.29 11.43,18.92 v8.66,18.92
  Bottom 0.203: C9.1 6.43,18.44 C7.2 6.41,19.18 8.66,19.18 v8.66,18.92
  other vias: 6.41,18.41
N$24
  Top 0.203: C12.1 U3.8
  pour Top (no thermals): 17.78,60.96 17.88,61.34 15.54,61.65 15.54,61.39 17.4,60.86
N$25  (via drill 0.25 pad 0.25)
  Top 0.203: U3.3 14.46,65.13 L2.1 15.94,68.22 L3.1 15.05,67.27 v15.04,67.26
  Bottom 0.203: v15.04,67.26 16.11,67.26 L4.1
  pour Top (no thermals): 16.51,67.31 16.08,67.31 16.08,67.34 14.43,65.13 16.69,66.75
N$26  (via drill 0.25 pad 0.25)
  Top 0.203: U3.5 13.96,59.32 12.33,57.69 | 12.33,57.69 C14.1 | v12.7,57.3 12.7,57.33 12.33,57.69
  Bottom 0.203: L6.1 v12.7,57.3
  pour Top (no thermals): 10.79,55.88 10.29,56.41 13.92,59.28 10.77,56.13
N$27  (via drill 0.25 pad 0.25)
  Top 0.203: U3.6 14.46,59.33 16.1,57.68 | 16.1,57.68 C13.1 | v15.72,57.28 15.72,57.3 16.1,57.68
  Bottom 0.203: L7.2 v15.72,57.28
  pour Top (no thermals): 17.78,55.88 18.14,56.39 14.5,59.28 17.65,56.13
N$30
  Bottom 0.203: R18.1 R19.2 23.67,15.18 JP11.1
N$37
  Top 0.406: JP10.2 22.99,53.96 L8.1
N$38
  Top 0.406: L9.2 5.36,53.86 JP14.2
N$39  (via drill 0.25 pad 0.25)
  Top 0.254: U5.6 v5.75,33.24 arc90 v5.74,33.25
  Bottom 0.203: v5.74,33.25 6.35,32.64 6.35,29.84 5.71,29.21 A0_SELECT.2
OEN  (via drill 0.25 pad 0.25)
  Top 0.203: U1.11 9.64,14.09 v8.89,13.34 | v8.89,6.3 8.89,3.81 J1.7
  Bottom 0.203: v8.89,13.34 v8.89,6.3
OF
  Top 0.203: U1.28 17.39,13.09 24.13,6.35 24.13,3.81 J1.19
OUT+
  Top 0.305: IF+.ANT 17.78,51.44 | C13.2 17.78,54.98 L8.2
  Top 0.813: C13.2 17.83,51.44 IF+.ANT
OUT-
  Top 0.305: 10.64,51.44 IF-.ANT | C14.2 10.64,54.98 L9.1
  Top 0.813: IF-.ANT 10.49,51.79 C14.2
SCL_3V3  (via drill 0.25 pad 0.25)
  Top 0.203: v7.85,16.51 6.99,16.51 2.81,20.68 Q4.2 | v13.97,6.35 13.97,3.81 J1.11
  Top 0.254: R29.1 1.27,22.54 Q4.2
  Bottom 0.203: v7.85,16.51 11.43,12.93 11.43,8.89 v13.97,6.35
SCL_5V  (via drill 0.25 pad 0.25)
  Top 0.254: U5.5 4.45,31.75 4.45,29.82 3.81,29.19 3.81,24.59 Q4.3
  Top 0.305: Q4.3 4.91,23.72 R27.2
  other vias: 4.5,24.13
SDA_3V3  (via drill 0.25 pad 0.25)
  Top 0.203: Q5.2 2.81,26.03 v1.85,25.07 | v11.43,6.35 11.43,3.81 J1.9
  Top 0.254: R30.2 1.53,26.35 Q5.2
  Bottom 0.203: v1.85,25.07 1.85,21.64 10.79,12.7 10.79,7.62 11.43,6.98 v11.43,6.35
SDA_5V  (via drill 0.25 pad 0.25)
  Top 0.254: U5.4 5.75,28.14 Q5.3
  Top 0.305: Q5.3 4.91,27.08 R28.1
  other vias: 4.5,26.67
SMP_CLK  (via drill 0.25 pad 0.25, 0.3 pad 0.25)
  Top 0.203: CLK.ANT | R17.2 10.35,16.56 U1.9 | v3.81,6.35 3.81,3.81 J1.1
  Top 0.305: CLK.ANT 8.26,15.09 | 8.26,15.09 v6.35,13.34 | 8.26,15.09 U1.9
  Bottom 0.305: v6.35,13.34 3.81,8.89 v3.81,6.35
  pour Top (no thermals): 3.81,15.24 4.5,15.75 5.79,15.09 4.5,14.43
VCCA  (via drill 0.25 pad 0.25)
  Top 0.203: 20.95,58.09 20.98,58.09 | 15.27,60.96 15.24,60.96 | v12.7,61.59 12.64,61.54 C16.2
  Top 0.254: U5.3 1.27,30.8 C17.1 C18.1
  Top 0.305: JP2.1 JP3.1 20.7,30.48 v18.95,30.48 | U3.7 14.96,61.24 | 14.96,61.24 15.24,60.96 15.37,60.86 | 20.95,58.09 18.95,58.09 15.37,60.86 | 20.95,58.09 23,56.05 23,55.1 23.16,54.94 23.19,54.94 23.19,56.16 21.26,58.09 20.95,58.09 | v14.99,60.73 15.37,60.86 | 15.37,60.86 15.27,60.96 | R24.2 8.26,61.54 | U5.3 3.17,30.77 v3.17,29.84 | 23.64,32.24 24.13,32.74 | 20.95,58.09 20.95,57.94 19,57.94 15.65,60.63 | 14.96,60.78 14.96,61.24
  Top 0.406: JP3.1 22.05,30.66 23.64,32.24 25.04,33.66 J3.2 26.67,17.31 U4.3 25.45,15.65 C1.1 | J4.2 2.6,61.54 4.45,61.54 | 4.45,61.54 8.26,61.54 C15.2 C16.2 | JP14.3 4.55,61.44 4.45,61.54
  Bottom 0.203: 14.2,61.59 14.15,61.59
  Bottom 0.254: A0_SELECT.1 5.66,28.4 R28.2 R27.1
  Bottom 0.305: 14.15,61.59 v12.7,61.59 | L6.2 14.2,55.03 | 14.2,55.03 L7.1 | 14.2,55.03 14.2,60.73 | 14.2,60.73 14.2,61.59 | v18.95,30.48 18.54,30.07 7.85,30.07 6.17,28.4 A0_SELECT.1 3.99,28.4 3.17,29.21 v3.17,29.84 | 14.2,60.73 v14.99,60.73
  pour Top (isolate 0.305): 22.86,55.25 22.86,19.05 24.13,17.78 24.13,13.34 27.94,13.34 27.94,55.3 23.19,55.6 23.14,54.97
VCM  (via drill 0.3 pad 0.25, 0.3 pad 0.41)
  Top 0.305: U1.31 17.12,14.59 v17.78,15.24 | 20.88,27.94 JP3.3 | 20.88,27.94 JP4.3 21.92,26.85 21.92,21.41 JP5.3 | JP8.3 6.58,21.41 6.58,26.85 JP7.3 7.62,27.94 | JP6.3 7.62,27.94 | 7.62,27.94 v8.89,27.94 | v20.32,27.94 20.88,27.94
  Bottom 0.305: U2.2 18.54,33.53 19.68,32.38 19.68,27.94 | v17.78,15.24 17.78,18.41 19.68,20.32 19.68,27.94 | v8.89,27.94 19.68,27.94 | 19.68,27.94 v20.32,27.94
VGC
  Top 0.254: U5.1 3.81,33.37 3.81,36.83 | Q2.1 3.81,40.34 3.81,36.83 | 3.81,36.83 3.81,36.51 Q3.1

### Text on the board
bNames: Connect to TP1 | TP1